# Altium schematic sheet ddr-simulation.SchDoc: Simulation DDR RAM Termination
size A3; Organization: Berne University of Applied Science; Address1: Quellgasse 21; Address2: CH-2501 Biel/Bienne; Address3: Switzerland; Revision: 1; SheetNumber: 1; SheetTotal: 1; Author: zac1; DrawnBy: zac1
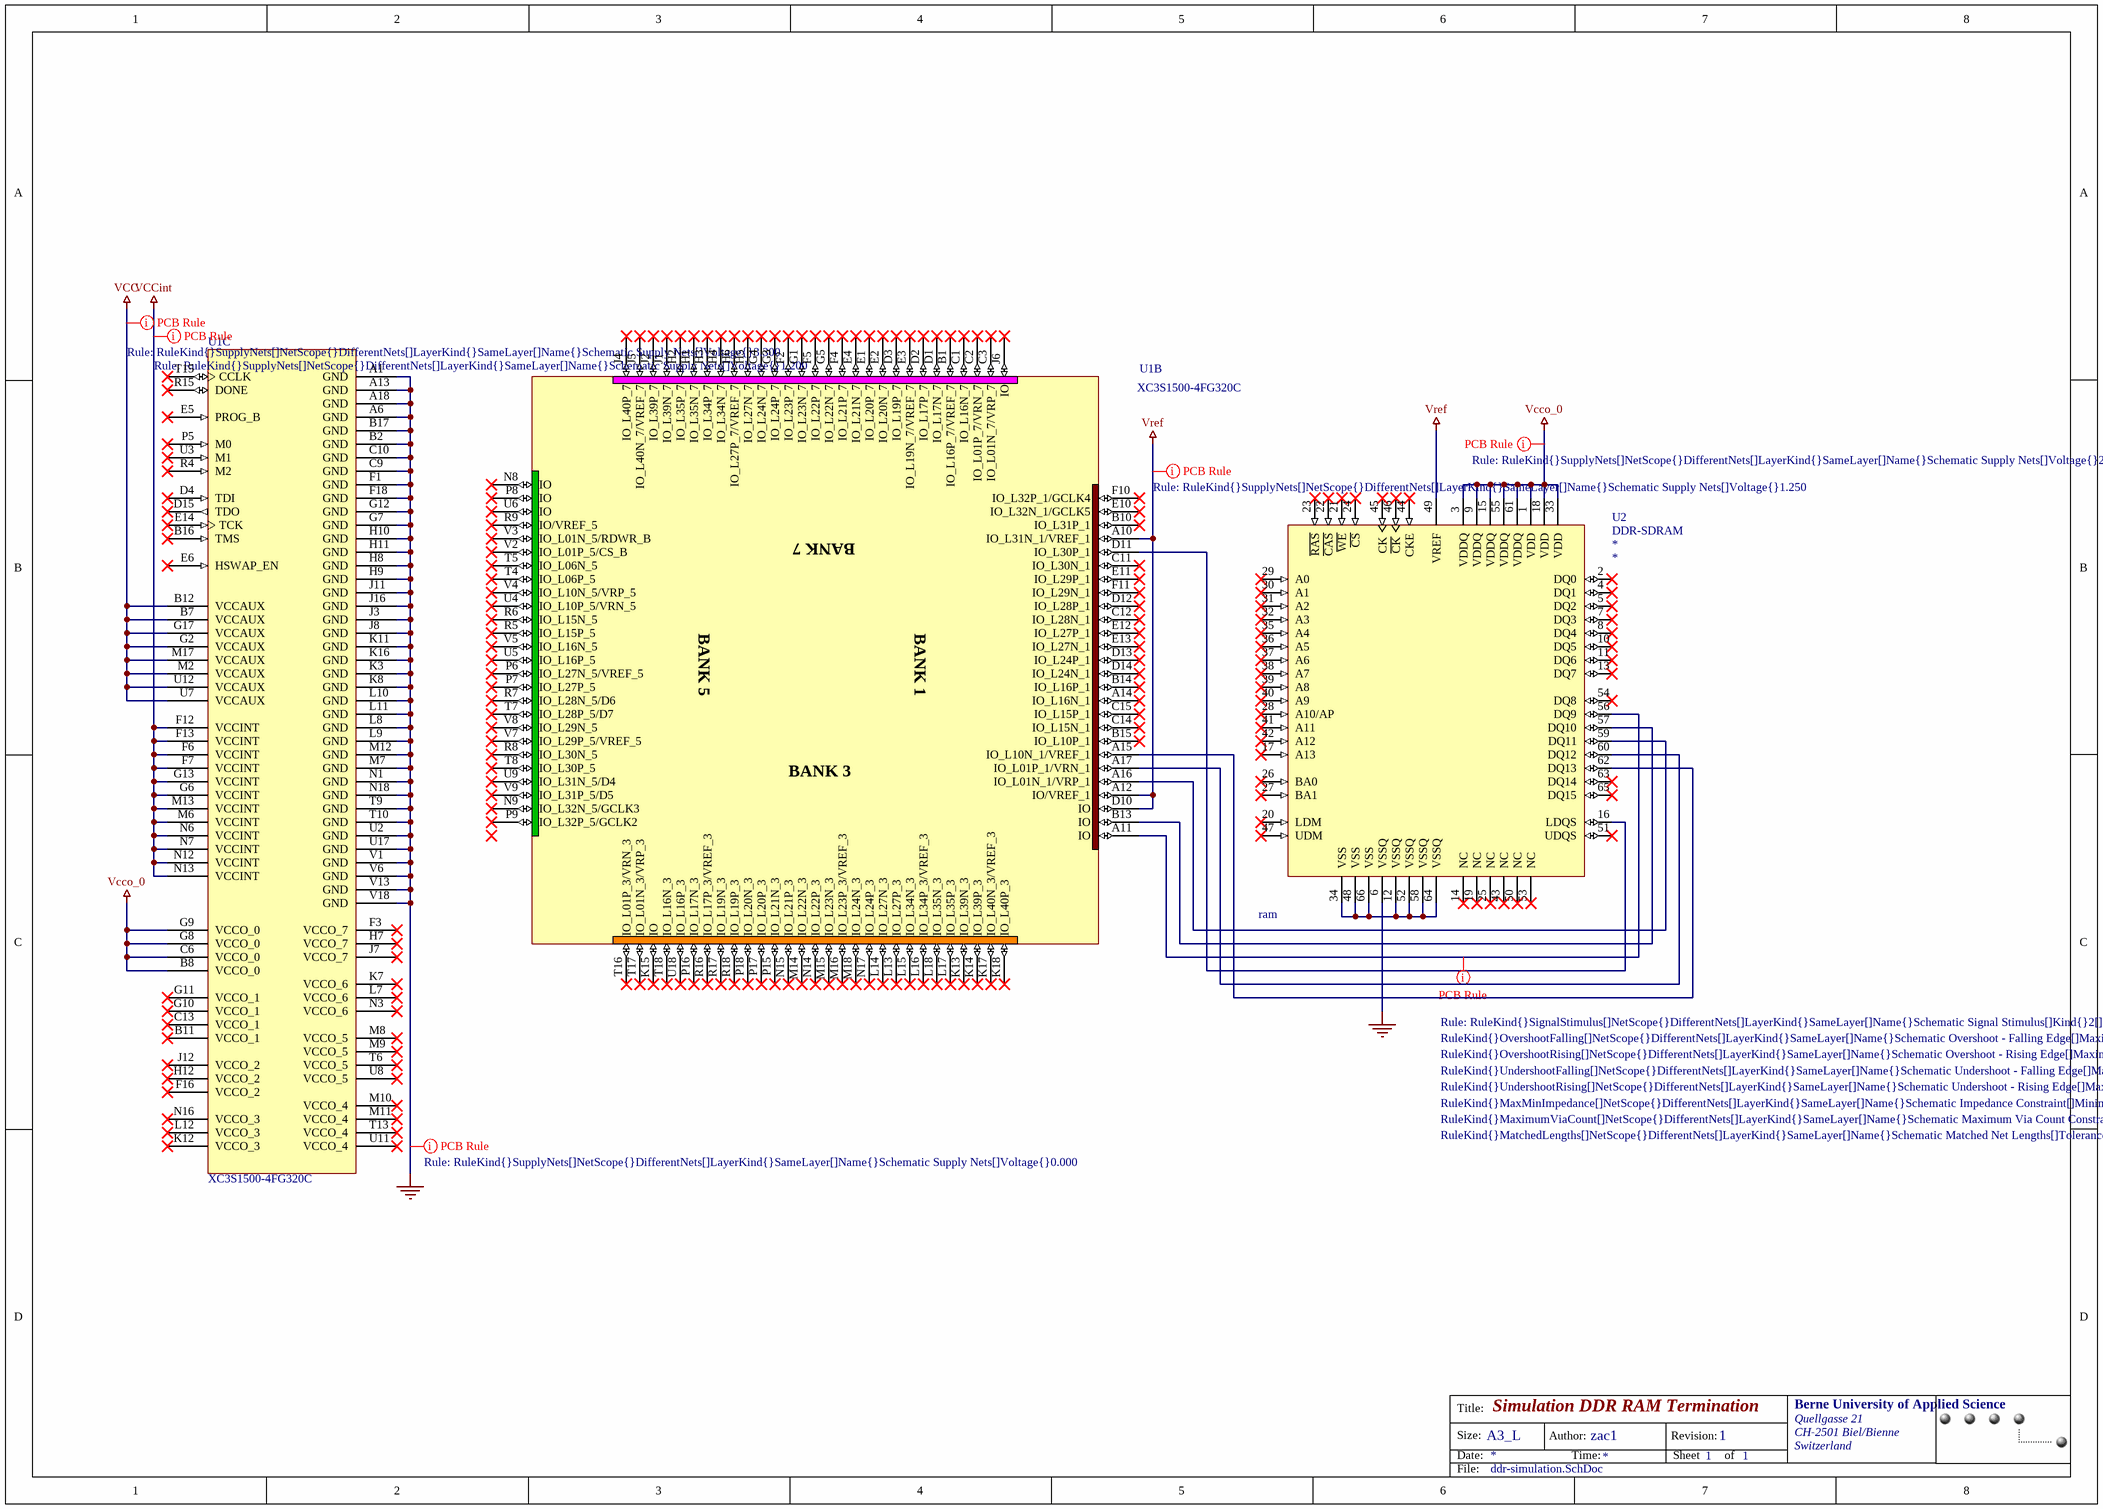
[diagram p0: ddr-simulation.SchDoc]

## Parts
?  CC License  [CC-License]  (value not drawn)
U1  XC3S1500-4FG320C  [FG320]  (parts B,C of 3)
U2  DDR-SDRAM  value ram  [TSOP66]

## Nets
GND: U1.A1(GND) U1.A6(GND) U1.A13(GND) U1.A18(GND) U1.B2(GND) U1.B17(GND) U1.C9(GND) U1.C10(GND) U1.F1(GND) U1.F18(GND) U1.G7(GND) U1.G12(GND) U1.H8(GND) U1.H9(GND) U1.H10(GND) U1.H11(GND) U1.J3(GND) U1.J8(GND) U1.J11(GND) U1.J16(GND) U1.K3(GND) U1.K8(GND) U1.K11(GND) U1.K16(GND) U1.L8(GND) U1.L9(GND) U1.L10(GND) U1.L11(GND) U1.M7(GND) U1.M12(GND) U1.N1(GND) U1.N18(GND) U1.T9(GND) U1.T10(GND) U1.U2(GND) U1.U17(GND) U1.V1(GND) U1.V6(GND) U1.V13(GND) U1.V18(GND) U2.6(VSSQ)
VCC: U1.B7(VCCAUX) U1.B12(VCCAUX) U1.G2(VCCAUX) U1.G17(VCCAUX) U1.M2(VCCAUX) U1.M17(VCCAUX) U1.U7(VCCAUX) U1.U12(VCCAUX)
VCCint: U1.F6(VCCINT) U1.F7(VCCINT) U1.F12(VCCINT) U1.F13(VCCINT) U1.G6(VCCINT) U1.G13(VCCINT) U1.M6(VCCINT) U1.M13(VCCINT) U1.N6(VCCINT) U1.N7(VCCINT) U1.N12(VCCINT) U1.N13(VCCINT)
Vcco_0: U1.B8(VCCO_0) U1.C6(VCCO_0) U1.G8(VCCO_0) U1.G9(VCCO_0) U2.1(VDD) U2.3(VDDQ) U2.9(VDDQ) U2.15(VDDQ) U2.18(VDD) U2.33(VDD) U2.55(VDDQ) U2.61(VDDQ)
Vref: U1.A10(IO_L31N_1/VREF_1) U1.A12(IO/VREF_1) U1.D10(IO) U2.49(VREF)
NetU1_A11: U1.A11(IO) U2.56(DQ9)
NetU1_A15: U1.A15(IO_L10N_1/VREF_1) U2.62(DQ13)
NetU1_A16: U1.A16(IO_L01N_1/VRP_1) U2.59(DQ11)
NetU1_A17: U1.A17(IO_L01P_1/VRN_1) U2.60(DQ12)
NetU1_B13: U1.B13(IO) U2.57(DQ10)
NetU1_D11: U1.D11(IO_L30P_1) U2.16(LDQS)
NetU2_12: U2.12(VSSQ) U2.34(VSS) U2.48(VSS) U2.52(VSSQ) U2.58(VSSQ) U2.64(VSSQ) U2.66(VSS)

Not connected (* = marked no-connect by the designer): U1 A14(IO_L16N_1)* B1(IO_L16P_7/VREF_7)* B10(IO_L31P_1)* B11(VCCO_1)* B14(IO_L16P_1)* B15(IO_L10P_1)* B16(TMS)* C1(IO_L16N_7)* C2(IO_L01P_7/VRN_7)* C3(IO_L01N_7/VRP_7)* C11(IO_L30N_1)* C12(IO_L28N_1)* C13(VCCO_1)* C14(IO_L15N_1)* C15(IO_L15P_1)* D1(IO_L17N_7)* D2(IO_L17P_7)* D3(IO_L19P_7)* D4(TDI)* D12(IO_L28P_1)* D13(IO_L24P_1)* D14(IO_L24N_1)* D15(TDO)* E1(IO_L20P_7)* E2(IO_L20N_7)* E3(IO_L19N_7/VREF_7)* E4(IO_L21N_7)* E5(PROG_B)* E6(HSWAP_EN)* E10(IO_L32N_1/GCLK5)* E11(IO_L29P_1)* E12(IO_L27P_1)* E13(IO_L27N_1)* E14(TCK)* F2(IO_L23P_7)* F3(VCCO_7)* F4(IO_L21P_7)* F5(IO_L22P_7)* F10(IO_L32P_1/GCLK4)* F11(IO_L29N_1)* F16(VCCO_2)* G1(IO_L23N_7)* G3(IO_L24P_7)* G4(IO_L24N_7)* G5(IO_L22N_7)* G10(VCCO_1)* G11(VCCO_1)* H1(IO_L35N_7)* H2(IO_L35P_7)* H3(IO_L34P_7)* H4(IO_L34N_7)* H5(IO_L27N_7)* H6(IO_L27P_7/VREF_7)* H7(VCCO_7)* H12(VCCO_2)* J1(IO_L39N_7)* J2(IO_L39P_7)* J4(IO_L40P_7)* J5(IO_L40N_7/VREF_7)* J6(IO)* J7(VCCO_7)* J12(VCCO_2)* K7(VCCO_6)* K12(VCCO_3)* K13(IO_L39N_3)* K14(IO_L39P_3)* K15(IO)* K17(IO_L40N_3/VREF_3)* K18(IO_L40P_3)* L7(VCCO_6)* L12(VCCO_3)* L13(IO_L27P_3)* L14(IO_L27N_3)* L15(IO_L34N_3)* L16(IO_L34P_3/VREF_3)* L17(IO_L35P_3)* L18(IO_L35N_3)* M8(VCCO_5)* M9(VCCO_5)* M10(VCCO_4)* M11(VCCO_4)* M14(IO_L22N_3)* M15(IO_L23N_3)* M16(IO_L23P_3/VREF_3)* M18(IO_L24N_3)* N3(VCCO_6)* N8(IO)* N9(IO_L32N_5/GCLK3)* N14(IO_L22P_3)* N15(IO_L21P_3)* N16(VCCO_3)* N17(IO_L24P_3)* P5(M0)* P6(IO_L27N_5/VREF_5)* P7(IO_L27P_5)* P8(IO)* P9(IO_L32P_5/GCLK2)* P15(IO_L21N_3)* P16(IO_L17N_3)* P17(IO_L20P_3)* P18(IO_L20N_3)* R4(M2)* R5(IO_L15P_5)* R6(IO_L15N_5)* R7(IO_L28N_5/D6)* R8(IO_L30N_5)* R9(IO/VREF_5)* R15(DONE)* R16(IO_L17P_3/VREF_3)* R17(IO_L19N_3)* R18(IO_L19P_3)* T4(IO_L06P_5)* T5(IO_L06N_5)* T6(VCCO_5)* T7(IO_L28P_5/D7)* T8(IO_L30P_5)* T13(VCCO_4)* T15(CCLK)* T16(IO_L01P_3/VRN_3)* T17(IO_L01N_3/VRP_3)* T18(IO_L16N_3)* U3(M1)* U4(IO_L10P_5/VRN_5)* U5(IO_L16P_5)* U6(IO)* U8(VCCO_5)* U9(IO_L31N_5/D4)* U11(VCCO_4)* U18(IO_L16P_3)* V2(IO_L01P_5/CS_B)* V3(IO_L01N_5/RDWR_B)* V4(IO_L10N_5/VRP_5)* V5(IO_L16N_5)* V7(IO_L29P_5/VREF_5)* V8(IO_L29N_5)* V9(IO_L31P_5/D5)*; U2 2(DQ0)* 4(DQ1)* 5(DQ2)* 7(DQ3)* 8(DQ4)* 10(DQ5)* 11(DQ6)* 13(DQ7)* 14(NC)* 17(A13)* 19(NC)* 20(LDM)* 21(~{WE})* 22(~{CAS})* 23(~{RAS})* 24(~{CS})* 25(NC)* 26(BA0)* 27(BA1)* 28(A10/AP)* 29(A0)* 30(A1)* 31(A2)* 32(A3)* 35(A4)* 36(A5)* 37(A6)* 38(A7)* 39(A8)* 40(A9)* 41(A11)* 42(A12)* 43(NC)* 44(CKE)* 45(CK)* 46(~{CK})* 47(UDM)* 50(NC)* 51(UDQS)* 53(NC)* 54(DQ8)* 63(DQ14)* 65(DQ15)*

## Layout directives
rule Supply Nets [Voltage =  3.300]: VCC
rule Supply Nets [Voltage =  1.200]: VCCint
rule Supply Nets [Voltage =  2.500]: Vcco_0
rule Supply Nets [Voltage =  1.250]: Vref
rule Supply Nets [Voltage =  0.000]: GND
rule Signal Stimulus [Kind - Periodic Pulse    Level - Low    Start Time =  0.000    Stop Time =  1.800n    Period Time =  3.600n]; rule Overshoot - Falling Edge [Max =  300.0m]; rule Overshoot - Rising Edge [Max =  300.0m]; rule Undershoot - Falling Edge [Max =  300.0m]; rule Undershoot - Rising Edge [Max =  300.0m]; rule Impedance Constraint [Min =  40.00    Max =  70.00    ]; rule Maximum Via Count Constraint [Max Count = 2]; rule Matched Net Lengths [Tolerance = 3.6mm    Style - 90 Degrees    Amplitude = 5.08mm    Gap = 0.508mm    ]: NetU1_A11

## Notes on the sheet
- Title:
- Size:
- Date:
- A3_L
- Author:
- Time:
- Revision:
- Sheet
- of
- File:
- (in symbol XC3S1500-4FG320C, part B) BANK 7; BANK 5; BANK 1; BANK 3

## Library data of the parts
U1 = XC3S1500-4FG320C: Spartan-3 1.2V FPGA, 221 User I/Os, 320-ball FBGA, Standard Performance, Commercial Grade; PackageDocument: ver1.2.1, Mar-2005; Published: 17-Dec-2003; LatestRevisionDate: 6-Jun-2005; LatestRevisionNote: Bubble removed from PROG_B pin.; DatasheetDocument: 04-Mar-2004; PackageReference: FG320; Publisher: Altium Limited; Code_JEDEC: MS-034-AAG-1; ComponentLink1Description: Manufacturer Link; ComponentLink1URL: http://www.xilinx.com/xlnx/xil_prodcat_landingpage.jsp?title=Spartan-3; ComponentLink2Description: Datasheet; ComponentLink2URL: http://direct.xilinx.com/bvdocs/publications/ds099.pdf; Value: XC3S1500-4FG320C
U2 = DDR-SDRAM: general model for ddr sdram's; vendor: *; type: *